# EasyEDA schematic FULL WAVE RECTIFIER SCHEMATIC.json
TITLE: Sheet_1; REV: 1.0; Date: 2023-09-12; Sheet: 1/1; Drawn By: pv8821; Company: Your Company
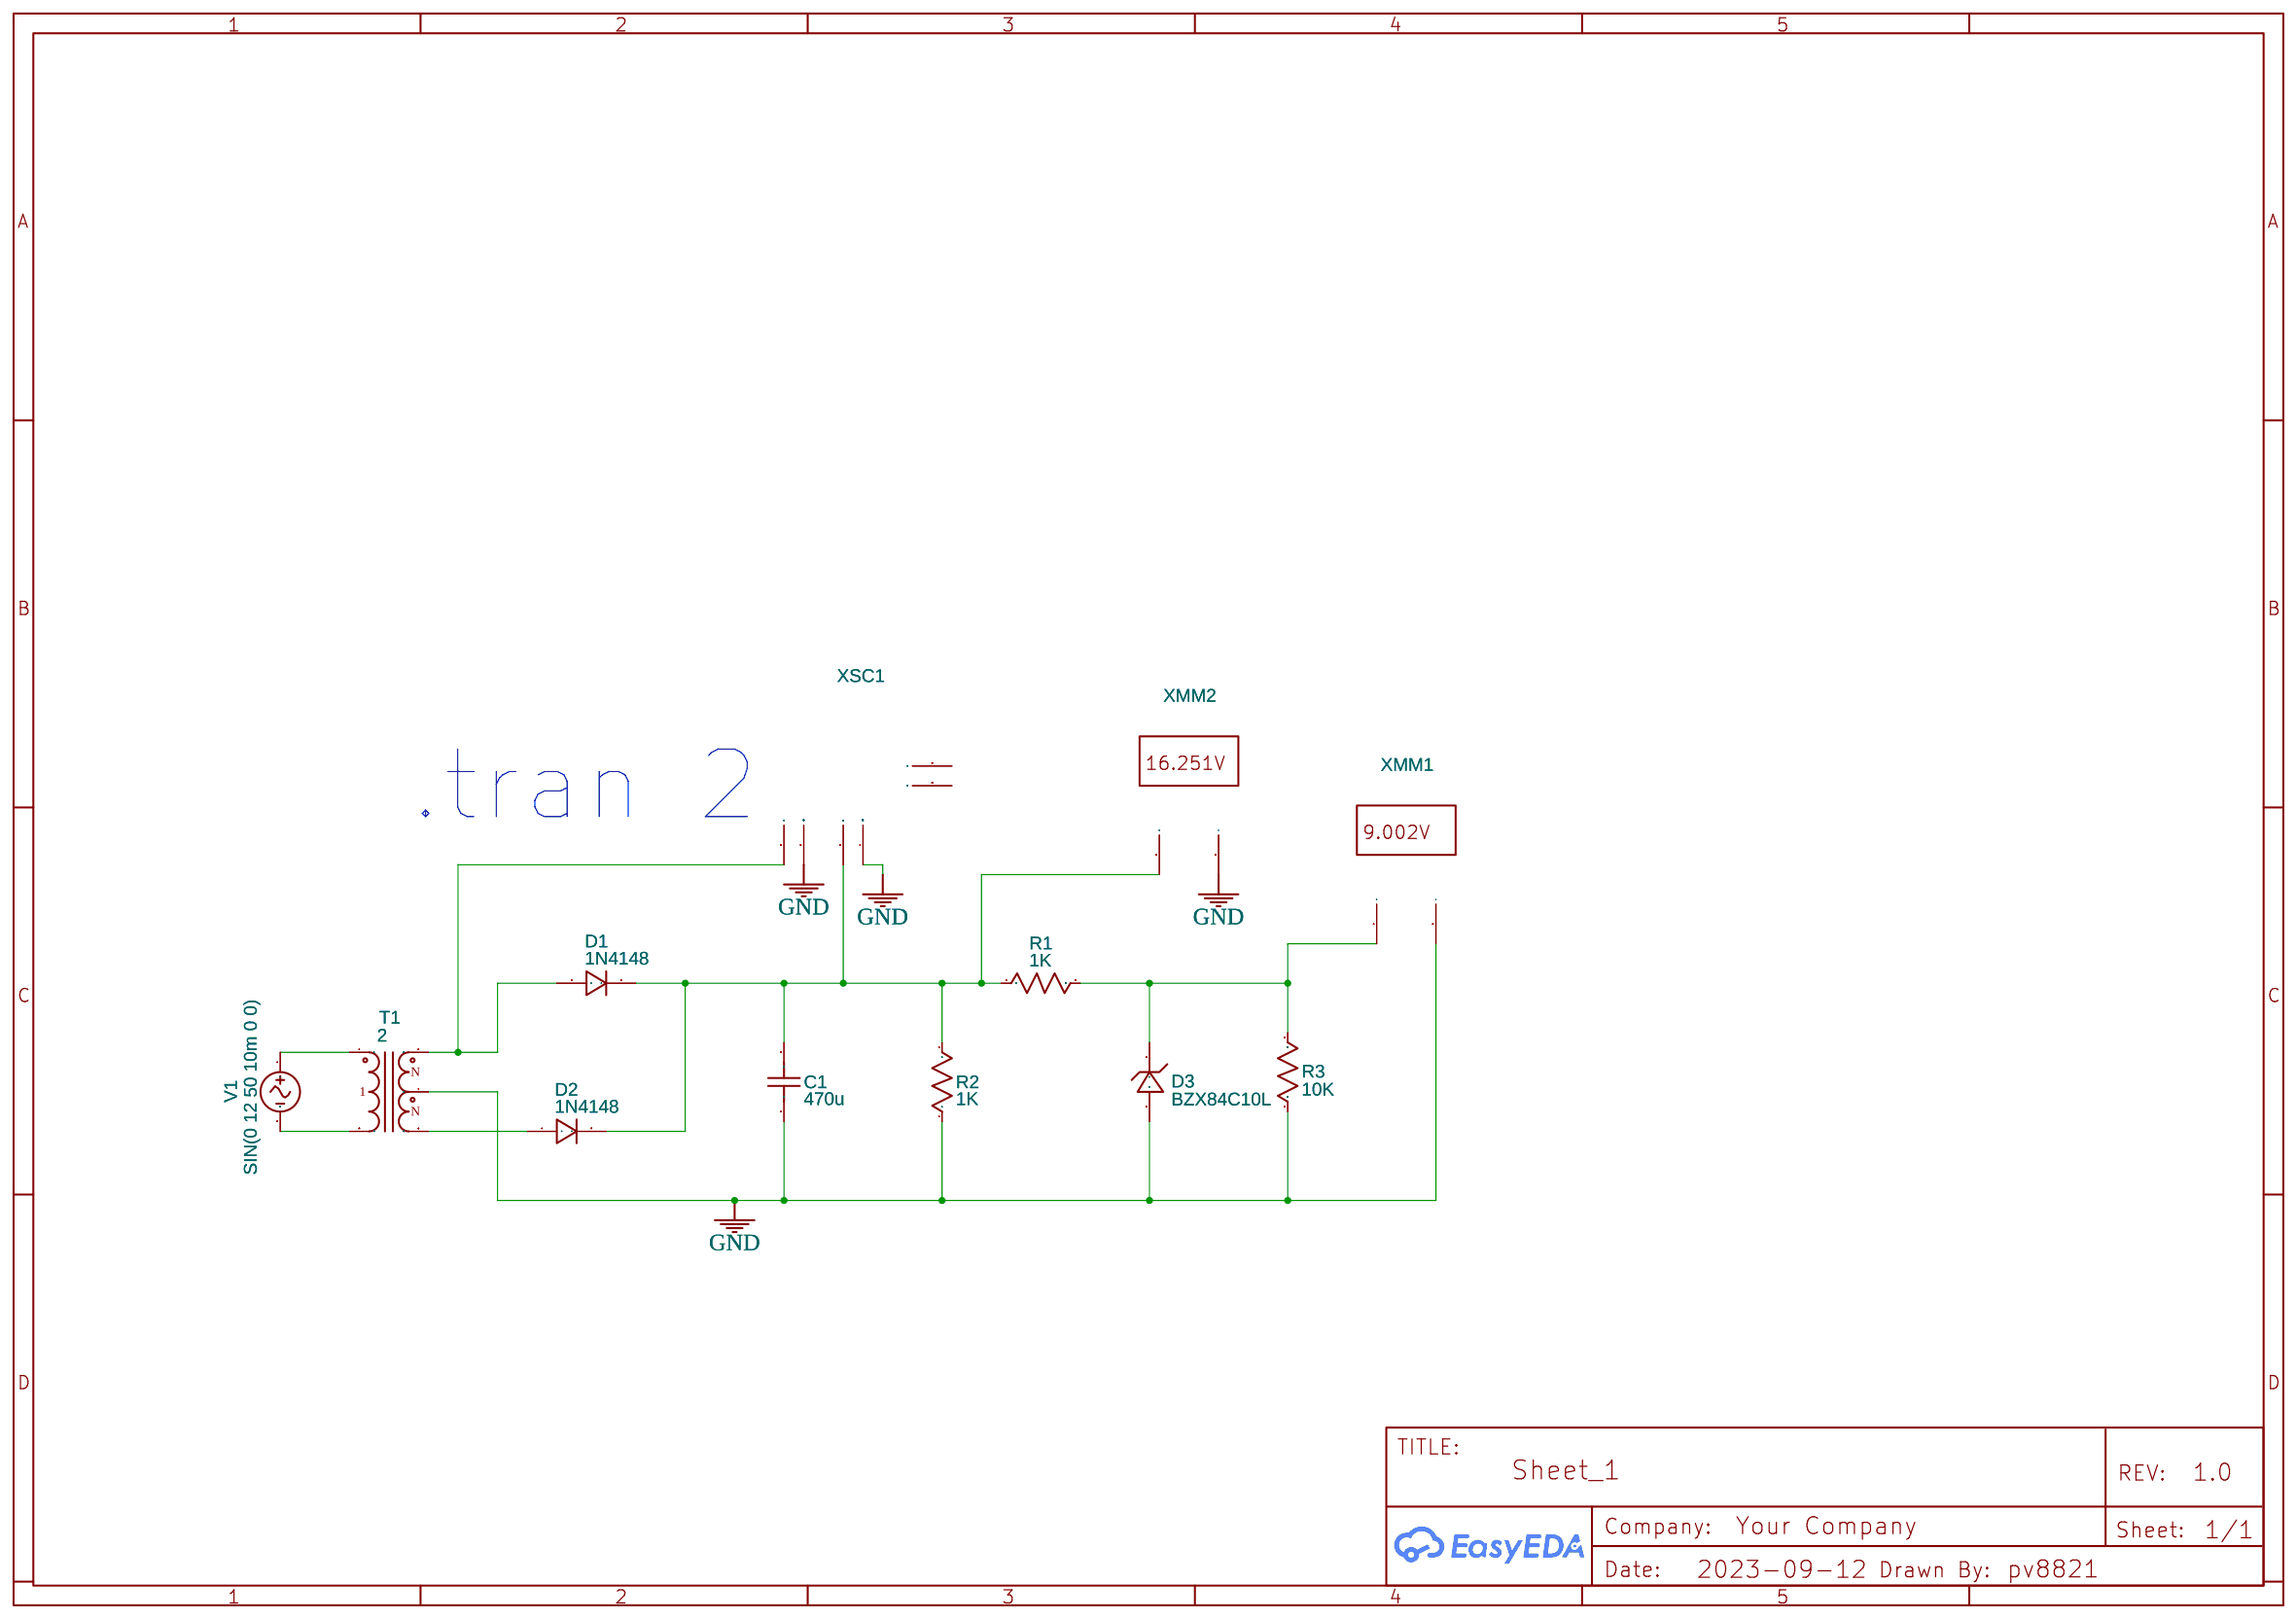
[diagram p0: schematic sheet]

## Parts
C1  470u  [RAD-0.1]
D1  1N4148  [DO-35]
D2  1N4148  [DO-35]
D3  BZX84C10L  [SMB]
R1  1K  [AXIAL-0.3]
R2  1K  [AXIAL-0.3]
R3  10K  [AXIAL-0.3]
T1  2
V1  SIN(0 12 50 10m 0 0)  [HDR1X2]
XMM1  Multimeter
XMM2  Multimeter
XSC1  Oscilloscope

## Library data of the parts
C1 = Capacitor_US: Contributor: EasyEDA; Supplier: YUJING; Capacitance: 1u
D1 D2 = 1N4148: Contributor: EasyEDA
D3 = BZX84C10L: Contributor: EasyEDA
R1-R3 = Resistor_US: Resistance: 1k; Contributor: EasyEDA; Supplier: YUJING
T1 = XFMR_TAP: Supplier: YUJING; Contributor: EasyEDA
V1 = VSin: Contributor: EasyEDA; sim: true
XMM1 XMM2 = MULTIMETER: Supplier: LCSC; Multimeter Type: Voltmeter; Power Type: AC; Voltmeter resistance: 10μ; Ammeter resistance: 1G; NameDisplay: 0; Contributor: EasyEDA; sim: true
XSC1 = OSCILLOSCOPE: Contributor: EasyEDA; NameDisplay: 0; sim: true

## Nets
GND: C1.1 D3.1(A) R2.1 R3.1 T1.4 XMM1.2(I) XMM2.2(I) XSC1.2(GND1) XSC1.4(GND2)
Net-(C1-2): C1.2 D1.2(K) D2.2(K) R1.1 R2.2 XMM2.1(+) XSC1.3(B)
Net-(D1-1): D1.1(A) T1.5 XSC1.1(A)
Net-(D2-1): D2.1(A) T1.3
Net-(D3-2): D3.2(K) R1.2 R3.2 XMM1.1(+)
Net-(T1-1): T1.1 V1.1
Net-(T1-2): T1.2 V1.2

Not connected (* = marked no-connect by the designer): XSC1 5(T+) 6(T-)

## Notes on the sheet
- .tran 2
